# Altium schematic sheet Schematic.SchDoc
size A2; SheetNumber: 1; SheetTotal: 1
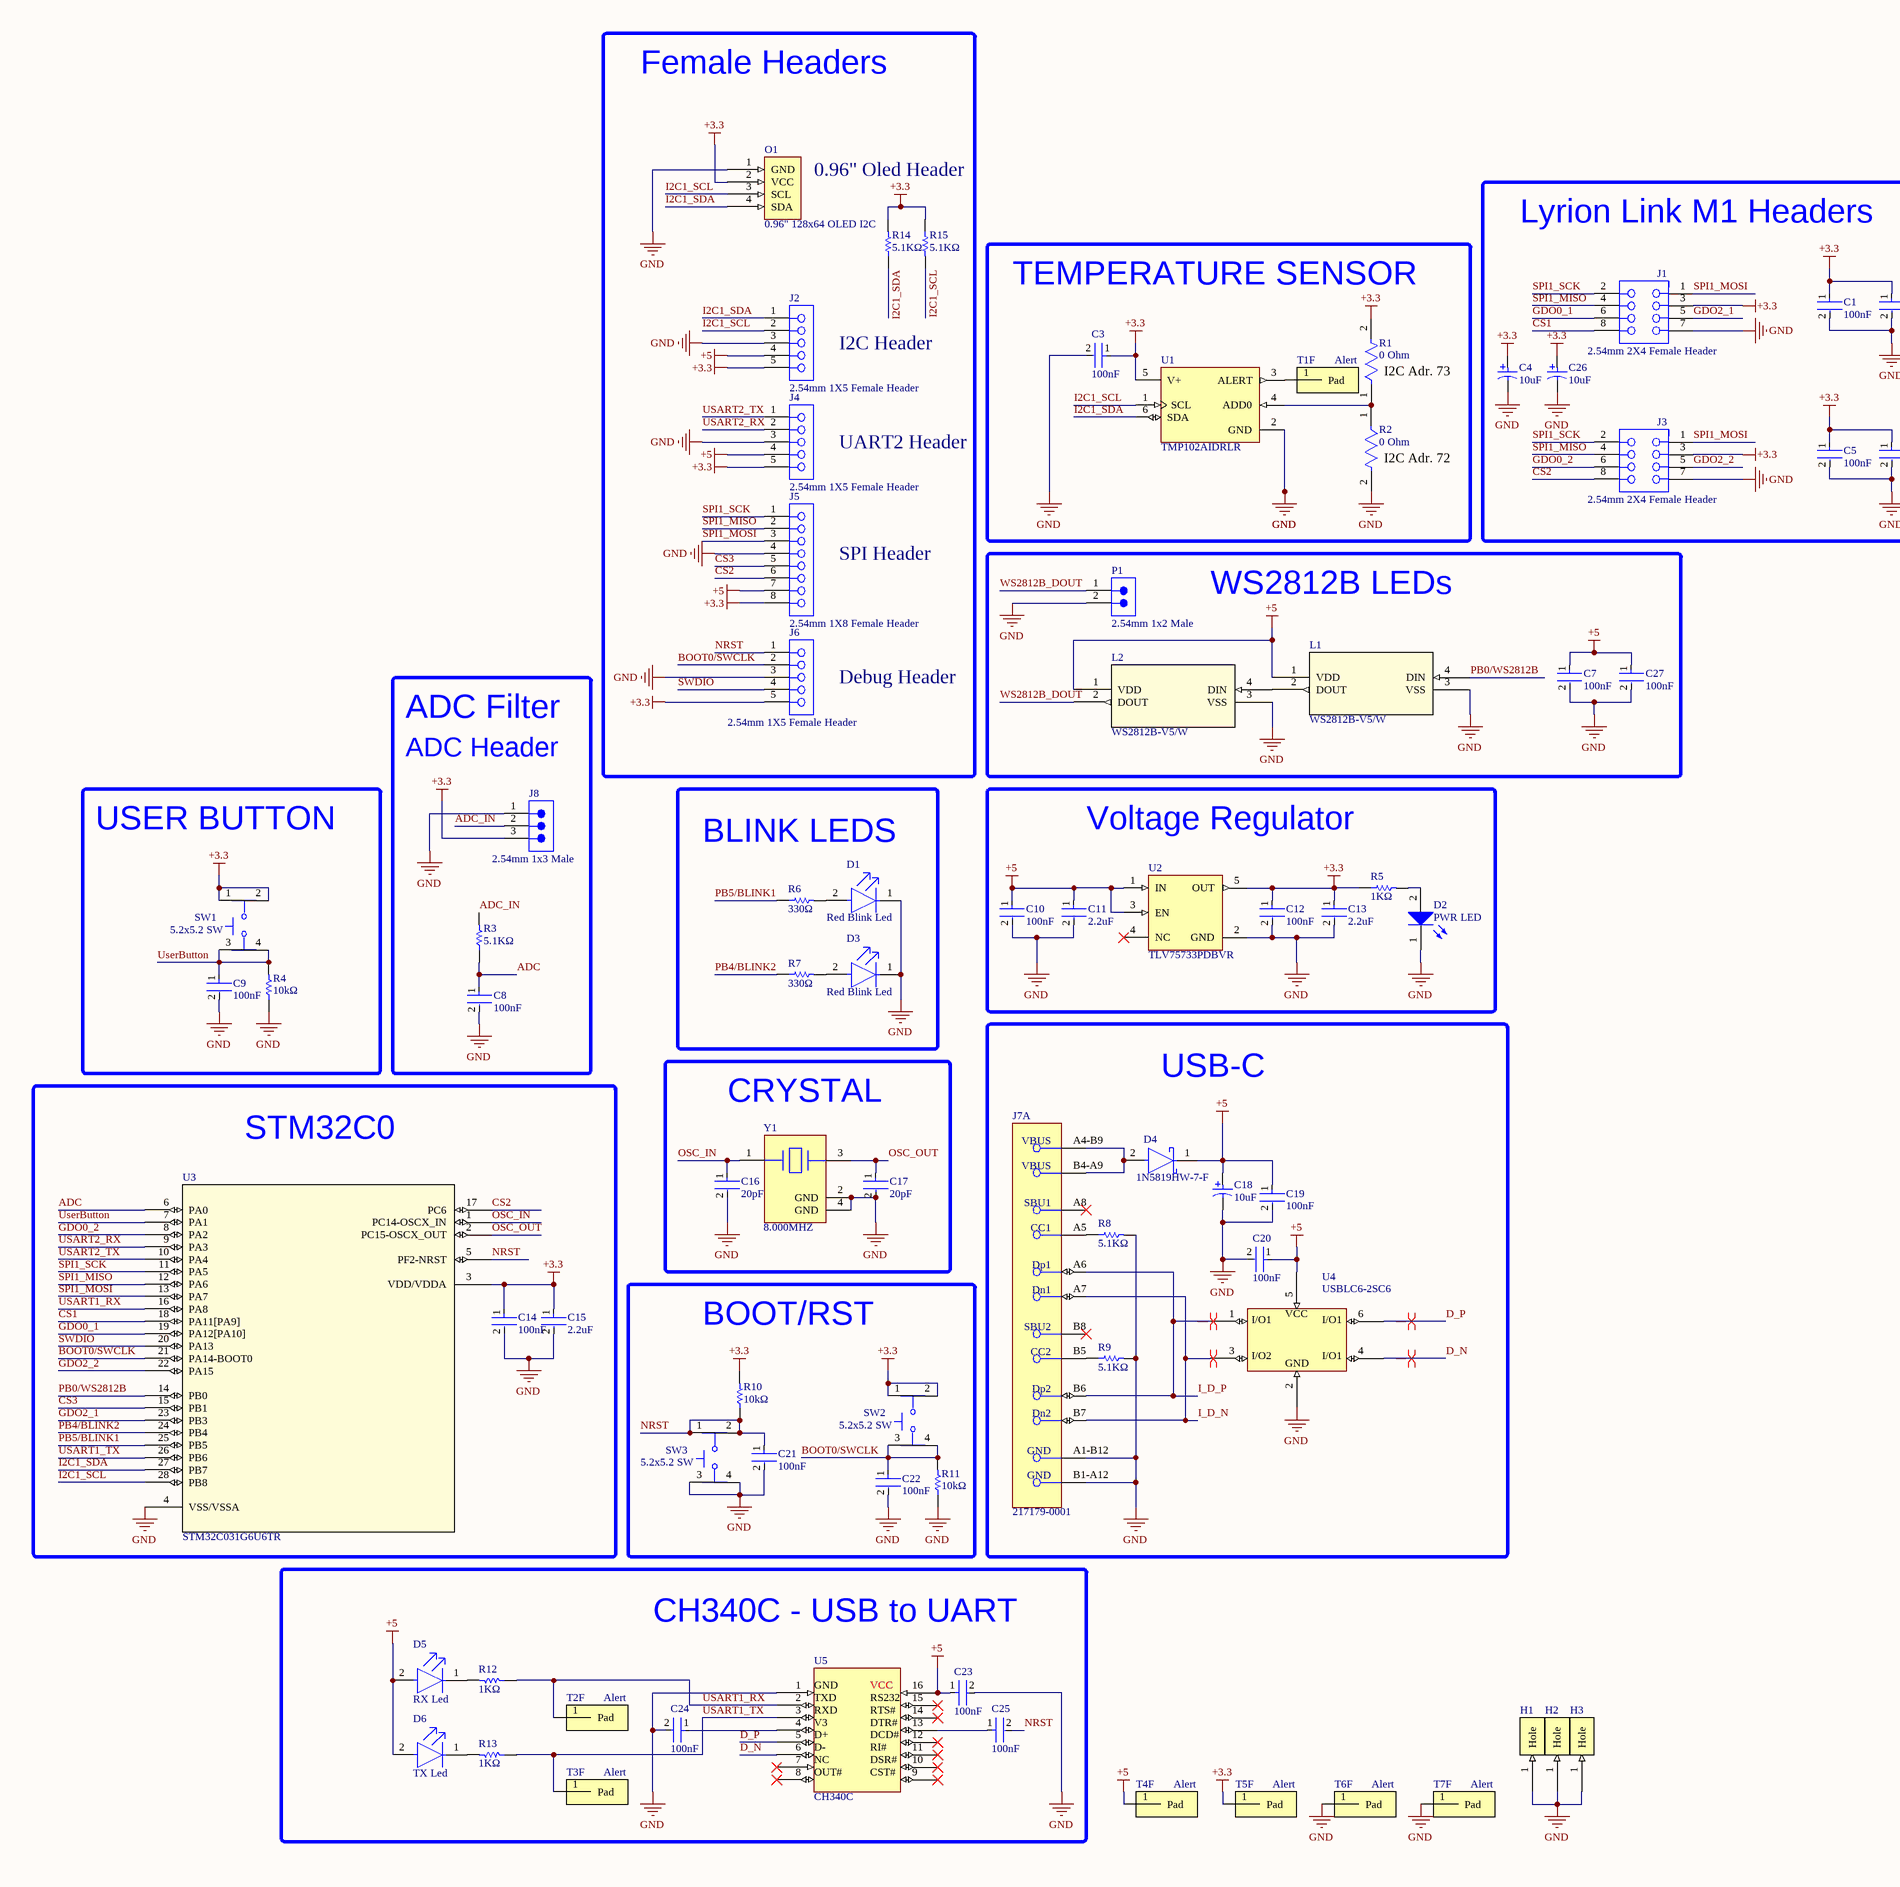
[diagram p0: Schematic.SchDoc, left]
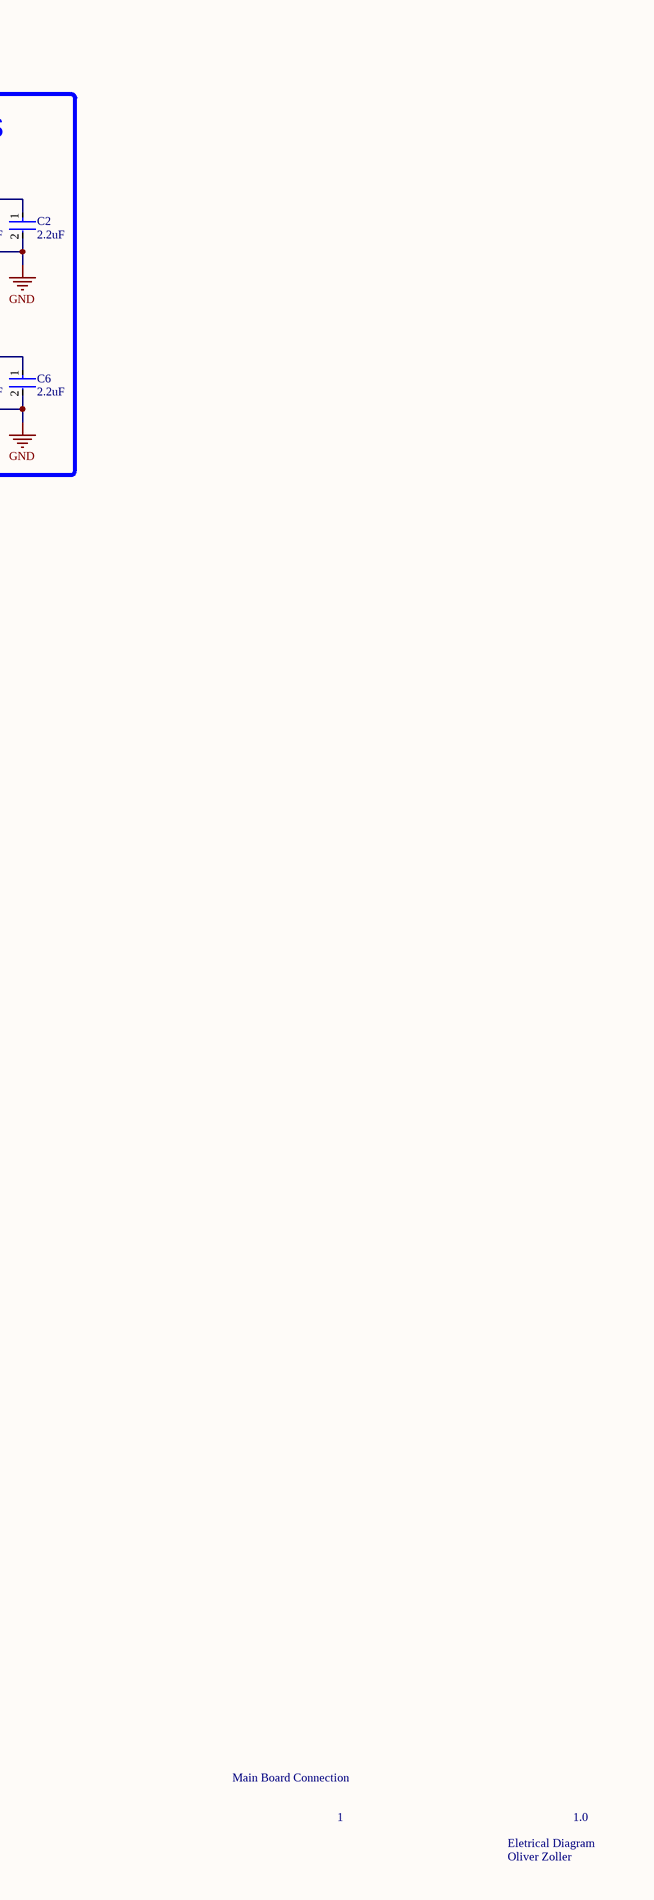
[diagram p1: Schematic.SchDoc, right]

## Parts
C1  100nF  [FP-CC0603-DA-IPC_B]
C2  2.2uF  [FP-CL10-IPC_B]
C3  100nF  [FP-CC0603-DA-IPC_B]
C4  10uF  [KEMT-A-3216-18-2_L]
C5  100nF  [FP-CC0603-DA-IPC_B]
C6  2.2uF  [FP-CL10-IPC_B]
C7  100nF  [FP-CC0603-DA-IPC_B]
C8  100nF  [FP-CC0603-DA-IPC_B]
C9  100nF  [FP-CC0603-DA-IPC_B]
C10  100nF  [FP-CC0603-DA-IPC_B]
C11  2.2uF  [FP-CL10-IPC_B]
C12  100nF  [FP-CC0603-DA-IPC_B]
C13  2.2uF  [FP-CL10-IPC_B]
C14  100nF  [FP-CC0603-DA-IPC_B]
C15  2.2uF  [FP-CL10-IPC_B]
C16  20pF  [FP-CC0603-0_9-IPC_A]
C17  20pF  [FP-CC0603-0_9-IPC_A]
C18  10uF  [KEMT-A-3216-18-2_L]
C19  100nF  [FP-CC0603-DA-IPC_B]
C20  100nF  [FP-CC0603-DA-IPC_B]
C21  100nF  [FP-CC0603-DA-IPC_B]
C22  100nF  [FP-CC0603-DA-IPC_B]
C23  100nF  [FP-CC0603-DA-IPC_B]
C24  100nF  [FP-CC0603-DA-IPC_B]
C25  100nF  [FP-CC0603-DA-IPC_B]
C26  10uF  [KEMT-A-3216-18-2_L]
C27  100nF  [FP-CC0603-DA-IPC_B]
D1  Red Blink Led  [FP-LTST-C190KRKT-MFG]
D2  PWR LED  [WL-SMCW_0603_150060xx75000]
D3  Red Blink Led  [FP-LTST-C190KRKT-MFG]
D4  1N5819HW-7-F  [FP-SOD123-IPC_C]
D5  RX Led  [FP-LTST-C190KRKT-MFG]
D6  TX Led  [FP-LTST-C190KRKT-MFG]
H1  M3 Mouting hole  [M3 Mouting hole-Footprint-1]  (value not drawn)
H2  M3 Mouting hole  [M3 Mouting hole-Footprint-1]  (value not drawn)
H3  M3 Mouting hole  [M3 Mouting hole-Footprint-1]  (value not drawn)
J1  2.54mm 2X4 Female Header  [61300821821]
J2  2.54mm 1X5 Female Header  [61300511821]
J3  2.54mm 2X4 Female Header  [61300821821]
J4  2.54mm 1X5 Female Header  [61300511821]
J5  2.54mm 1X8 Female Header  [61300811821]
J6  2.54mm 1X5 Female Header  [61300511821]
J7  217179-0001  [FP-2171790001-MFG]  (part A of 2)
J8  2.54mm 1x3 Male  [61300311121]
L1  WS2812B-V5/W  [WS2812B-V5_W-Footprint-1]
L2  WS2812B-V5/W  [WS2812B-V5_W-Footprint-1]
O1  0.96" 128x64 OLED I2C  [0.96" 128x64 OLED I2C-Footprint-1]
P1  2.54mm 1x2 Male  [61300211121]
R1  0 Ohm  [FP-RC0603-MFG]
R2  0 Ohm  [FP-RC0603-MFG]
R3  5.1KΩ  [RESC1608X55X25ML10T15]
R4  10kΩ  [RESC1609X50X30ML8T20]
R5  1KΩ  [RESC1608X55X25ML10T15]
R6  330Ω  [RESC1608X55X25LL10T15]
R7  330Ω  [RESC1608X55X25LL10T15]
R8  5.1KΩ  [RESC1608X55X25ML10T15]
R9  5.1KΩ  [RESC1608X55X25ML10T15]
R10  10kΩ  [RESC1609X50X30ML8T20]
R11  10kΩ  [RESC1609X50X30ML8T20]
R12  1KΩ  [RESC1608X55X25ML10T15]
R13  1KΩ  [RESC1608X55X25ML10T15]
R14  5.1KΩ  [RESC1608X55X25ML10T15]
R15  5.1KΩ  [RESC1608X55X25ML10T15]
SW1  5.2x5.2 SW  [FP-TL3342F450QG-MFG]
SW2  5.2x5.2 SW  [FP-TL3342F450QG-MFG]
SW3  5.2x5.2 SW  [FP-TL3342F450QG-MFG]
T1  Alert  [Test Pad-Footprint-1]  (part F of 6)
T2  Alert  [Test Pad-Footprint-1]  (part F of 6)
T3  Alert  [Test Pad-Footprint-1]  (part F of 6)
T4  Alert  [Test Pad-Footprint-1]  (part F of 6)
T5  Alert  [Test Pad-Footprint-1]  (part F of 6)
T6  Alert  [Test Pad-Footprint-1]  (part F of 6)
T7  Alert  [Test Pad-Footprint-1]  (part F of 6)
U1  TMP102AIDRLR  [FP-DRL0006A-MFG]
U2  TLV75733PDBVR  [FP-DBV0005A-MFG]
U3  STM32C031G6U6TR  [UFQFPN-28_STM]
U4  USBLC6-2SC6  [STM-SOT23-6L_V]
U5  CH340C  [CH340C-Footprint-1]
Y1  8.000MHZ  [FP-ABM3B-MFG]

## Blocks framed on the sheet
Female Headers: J2 J4-J6 O1 R14 R15
Lyrion Link M1 Headers: C1 C2 C4-C6 C26 J1 J3
TEMPERATURE SENSOR: C3 R1 R2 T1 U1
WS2812B LEDs: C7 C27 L1 L2 P1
ADC Filter: C8 J8 R3
USER BUTTON: C9 R4 SW1
BLINK LEDS: D1 D3 R6 R7
Voltage Regulator: C10-C13 D2 R5 U2
USB-C: C18-C20 D4 J7 R8 R9 U4
CRYSTAL: C16 C17 Y1
STM32C0: C14 C15 U3
BOOT/RST: C21 C22 R10 R11 SW2 SW3
CH340C - USB to UART: C23-C25 D5 D6 R12 R13 T2 T3 U5

## Nets
+3.3: C1.1 C2.1 C3.1 C4.1 C5.1 C6.1 C12.1 C13.1 C14.1 C15.1 C26.1 J1.3 J2.5 J3.3 J4.5 J5.8 J6.5 J8.3 O1.2(VCC) R1.2 R5.1 R10.2 R14.2 R15.1 SW1.1 SW1.2 SW2.1 SW2.2 T5.1(Pad) U1.5(V+) U2.5(OUT) U3.3(VDD/VDDA)
+5: C7.1 C10.1 C11.1 C18.1 C19.1 C20.1 C23.1 C27.1 D4.1(C) D5.2(A) D6.2(A) J2.4 J4.4 J5.7 L1.1(VDD) L2.1(VDD) T4.1(Pad) U2.1(IN) U2.3(EN) U4.5 U5.16
GND: C1.2 C2.2 C3.2 C4.2 C5.2 C6.2 C7.2 C8.2 C9.2 C10.2 C11.2 C12.2 C13.2 C14.2 C15.2 C16.2 C17.2 C18.2 C19.2 C20.2 C21.2 C22.2 C23.2 C24.2 C26.2 C27.2 D1.1(C) D2.1(K) D3.1(C) H1.1(Hole) H2.1(Hole) H3.1(Hole) J1.7 J2.3 J3.7 J4.3 J5.4 J6.3 J7.A1-B12(GND) J7.B1-A12(GND) J8.1 L1.3(VSS) L2.3(VSS) O1.1(GND) P1.2 R2.2 R4.1 R8.2 R9.2 R11.1 SW3.3 SW3.4 T6.1(Pad) T7.1(Pad) U1.2(GND) U2.2(GND) U3.4(VSS/VSSA) U4.2 U5.1 Y1.2(GND) Y1.4(GND)
ADC: C8.1 R3.1 U3.6(PA0)
ADC_IN: J8.2 R3.2
BOOT0/SWCLK: C22.1 J6.2 R11.2 SW2.3 SW2.4 U3.21(PA14-BOOT0)
CS1: J1.8 U3.18(PA11[PA9])
CS2: J3.8 J5.6 U3.17(PC6)
CS3: J5.5 U3.15(PB1)
D_N: U4.4 U5.6
D_P: U4.6 U5.5
GDO0_1: J1.6 U3.19(PA12[PA10])
GDO0_2: J3.6 U3.8(PA2)
GDO2_1: J1.5 U3.23(PB3)
GDO2_2: J3.5 U3.22(PA15)
I2C1_SCL: J2.2 O1.3(SCL) R15.2 U1.1(SCL) U3.28(PB8)
I2C1_SDA: J2.1 O1.4(SDA) R14.1 U1.6(SDA) U3.27(PB7)
I_D_N: J7.A7(Dn1) J7.B7(Dn2) U4.3
I_D_P: J7.A6(Dp1) J7.B6(Dp2) U4.1
NRST: C21.1 C25.2 J6.1 R10.1 SW3.1 SW3.2 U3.5(PF2-NRST)
OSC_IN: C16.1 U3.1(PC14-OSCX_IN) Y1.1
OSC_OUT: C17.1 U3.2(PC15-OSCX_OUT) Y1.3
PB0/WS2812B: L1.4(DIN) U3.14(PB0)
PB4/BLINK2: R7.1 U3.24(PB4)
PB5/BLINK1: R6.1 U3.25(PB5)
SPI1_MISO: J1.4 J3.4 J5.2 U3.12(PA6)
SPI1_MOSI: J1.1 J3.1 J5.3 U3.13(PA7)
SPI1_SCK: J1.2 J3.2 J5.1 U3.11(PA5)
SWDIO: J6.4 U3.20(PA13)
USART1_RX: R12.1 T2.1(Pad) U3.16(PA8) U5.2
USART1_TX: R13.1 T3.1(Pad) U3.26(PB6) U5.3
USART2_RX: J4.2 U3.9(PA3)
USART2_TX: J4.1 U3.10(PA4)
UserButton: C9.1 R4.2 SW1.3 SW1.4 U3.7(PA1)
WS2812B_DOUT: L2.2(DOUT) P1.1
NetC24_1: C24.1 U5.4
NetC25_1: C25.1 U5.13
NetD1_2: D1.2(A) R6.2
NetD2_2: D2.2(A) R5.2
NetD3_2: D3.2(A) R7.2
NetD4_2: D4.2(A) J7.A4-B9(VBUS) J7.B4-A9(VBUS)
NetD5_1: D5.1(C) R12.2
NetD6_1: D6.1(C) R13.2
NetJ7_A5: J7.A5(CC1) R8.1
NetJ7_B5: J7.B5(CC2) R9.1
NetL1_2: L1.2(DOUT) L2.4(DIN)
NetR1_1: R1.1 R2.1 U1.4(ADD0)
NetT1_1: T1.1(Pad) U1.3(ALERT)

Not connected (* = marked no-connect by the designer): J7 A8(SBU1)* B8(SBU2)*; U2 4(NC)*; U5 7* 8* 9* 10* 11* 12* 14* 15*

## Layout directives
differential pair; net class USB: D_N, D_P, I_D_N, I_D_P

## Notes on the sheet
- 0.96" Oled Header
- I2C Header
- (near R1) I2C Adr. 73
- UART2 Header
- (near R2) I2C Adr. 72
- SPI Header
- Debug Header
- ADC Header
- Main Board Connection
- 1
- Oliver Zoller
- Eletrical Diagram
- 1.0
- (in symbol CMP-005-000002-2) VCC; I/O1; I/O2; GND
- (in symbol CMP-005-000004-1) GND; VCC; TXD; RS232; RXD; RTS#; V3; DTR#; D+; DCD#; D-; RI#; NC; DSR#; OUT#; CST#

## Library data of the parts
C1 C3 C5 C7-C10 C12 C14 C19-C25 C27 = CMP-00018-3: 100nF 0603 10% 50V; Dielectric Material: Ceramic; Dielectric: X7R; Introduction Date: 2005-08-18; Width: 800µm; Length: 1.6mm; RoHS: Compliant; REACH SVHC: Yes; Number of Terminals: 2; Height: 800µm; Halogen Free: Halogen Free; Harmonized Tariff Schedule (HTS) Code: 8532.24.00.20; Voltage: 50V; Schedule B: 8532240020, 8532240020; Voltage Rating (DC): 50V; Case Code (Imperial): 0603; Value: 100nF; Lead Free: Lead Free; Pins: 2; Thickness: 889µm; Max Operating Temperature: 125°C; Voltage Rating: 50V; Depth: 800µm; Lifecycle Status: Production; Export Control Classification Number (ECCN) Code: EAR99; Material: Ceramic; Termination: SMD/SMT; China RoHS: Compliant; Country of Origin: Mainland China, Taiwan; Case Code (Metric): 1608; Radiation Hardening: No; Tolerance: 10%; Mounting Technology: Surface Mount; Case/Package: 0603; Min Operating Temperature: -55°C
C2 C6 C11 C13 C15 = CMP-00001-2: 2.2uF 0603 10% 16V; Material: Ceramic; Dielectric: X5R; Value: 2.2µF; Tolerance: 10%; Harmonized Tariff Schedule (HTS) Code: 8532.24.00.20; Width: 800µm; Contact Plating: Tin; Depth: 800µm; Lifecycle Status: Production; Max Operating Temperature: 85°C; Voltage: 16V; Case Code (Metric): 1608; Mounting Technology: Surface Mount; Voltage Rating (DC): 16V; RoHS: Compliant; Voltage Rating: 16V; Number of Terminals: 2; Case/Package: 0603; Case Code (Imperial): 0603; Radiation Hardening: No; Schedule B: 8532240020, 8532240020; Height: 900µm; Country of Origin: Mainland China, Philippines, South Korea; REACH SVHC: Yes; Export Control Classification Number (ECCN) Code: EAR99; Min Operating Temperature: -55°C; Dielectric Material: Ceramic; Thickness: 889µm; Length: 1.6mm; Lead Free: Lead Free; China RoHS: Compliant; Introduction Date: 2007-03-23
C4 C18 C26 = CMP-00003-2: 10uF 0603 10%; Voltage Rating (DC): 10V; Life (Hours): 2000hours; Value: 10µF; Ripple Current: 55mA; Polarity: Polar; ESR (Equivalent Series Resistance): 3.8Ω; Leakage Current: 1µA; Dielectric Material: Tantalum; Dissipation Factor: 6%; Lifecycle Status: Production; Voltage: 10V; Length: 3.2mm; Packaging: Cut Tape; Features: General Purpose; Lead Free: Lead Free; Pins: 2; Width: 1.6mm; Case Code (Imperial): 1206; Termination: SMD/SMT; Min Operating Temperature: -55°C; RoHS: Compliant; Case Code (Metric): 3216; Height: 1.6mm; Depth: 1.6mm; Schedule B: 8532210050, 8532210050; Case/Package: 1206; REACH SVHC: Yes; Mounting Technology: Surface Mount; Max Operating Temperature: 125°C; Voltage Rating: 10V; Tolerance: 10%; China RoHS: Compliant; Height - Seated (Max): 1.8034mm; Number of Terminals: 2
C16 C17 = CMP-00011-2: 20pF 0603 5% 50V; Material: Ceramic; Temperature Coefficient: 30ppm/°C; Dielectric: C0G; Thickness: 889µm; Mounting Technology: Surface Mount; Case/Package: 0603; Composition: Ceramic; Max Operating Temperature: 125°C; REACH SVHC: Yes; Width: 800µm; Pins: 2; Case Code (Metric): 1608; Min Operating Temperature: -55°C; Length: 1.6mm; Voltage Rating (DC): 50V; RoHS: Compliant; Value: 20pF; Height: 800µm; Lifecycle Status: Production; China RoHS: Compliant; Lead Free: Lead Free; Schedule B: 8532240020, 8532240020; Case Code (Imperial): 0603; Number of Terminals: 2; Dielectric Material: Ceramic; Weight: 2.012816mg; Tolerance: 5%; Halogen Free: Halogen Free; Voltage Rating: 50V; Depth: 800µm; Termination: SMD/SMT
D1 D3 D5 D6 = CMP-00006-1: LED red 0603 wavelength 631nm light intensity 18~180mcd Front Mounting; Lens Style: Clear; Number of Circuits: 1; Forward Current: 25mA; Shape: Rectangular; Test Current: 20mA; Power Dissipation: 62.5mW; Reverse Voltage: 5V; Tolerance: 20%; Voltage Rating: 50V; Viewing Angle: 260°; Forward Voltage: 2.4V; Value: 100µF; Lens Color: Clear, Colorless; Power Rating: 75mW; Luminous Intensity: 18mcd; Peak Wavelength: 639nm; Color: Red; Schedule B: 8541402000, 8541402000; Export Control Classification Number (ECCN) Code: EAR99; Diameter: 8mm; Lead Pitch: 3.5mm; Harmonized Tariff Schedule (HTS) Code: 8541.40.20.00; Case Code (Metric): 1608; Number of LEDs: 1; Wavelength: 631nm; Height: 800µm; Lead Free: Lead Free; Max Operating Temperature: 85°C; Lens Transparency: Clear; Width: 800µm; Number of Elements: 1; Mounting Technology: Surface Mount; Country of Origin: Mainland China; Illumination Color: Red; REACH SVHC: Yes; RoHS: Compliant; Dominant Wavelength: 631nm; Case/Package: 0603; Packaging: Bulk; Length: 11.5mm; Radiation Hardening: No; Number of Terminals: 2; Min Operating Temperature: -30°C; Case Code (Imperial): 0603; Lifecycle Status: Production; Introduction Date: 2000-01-01; China RoHS: Compliant; Depth: 800µm; Voltage Rating (DC): 50V; Pins: 2
D2 = CMP-00005-1: WL-SMCW SMT Mono-Color Chip LED Waterclear; Peak Wavelength: 465nm; Reverse Voltage: 5V; Max Junction Temperature (Tj): 95°C; Viewing Angle: 140°; Wavelength: 470nm; Luminous Intensity: 145mcd; Lens Style: Clear, Rectangular; Forward Current: 100mA; Power Dissipation: 105mW; Test Current: 20mA; Color: Blue; Forward Voltage: 3.2V; Length: 1.6mm; Dominant Wavelength: 470nm; Max Operating Temperature: 85°C; Width: 800µm; REACH SVHC: Unknown; Case/Package: 0603; Packaging: Tape and Reel; Max Reverse Voltage (DC): 5V; Mounting Technology: Surface Mount; Case Code (Metric): 1608; Min Operating Temperature: -40°C; RoHS: Compliant; Height: 700µm; Case Code (Imperial): 0603
D4 = CMP-00060-1: Schottky Diode SOD-123 40V 1A; Forward Voltage: 750mV; Peak Reverse Current: 1mA; Value: 50pF; Max Junction Temperature (Tj): 125°C; Max Power Dissipation: 450mW; Max Forward Surge Current (Ifsm): 25A; Number of Elements: 1; Polarity: Standard; Element Configuration: Single; Packaging: Tape and Reel; China RoHS: Compliant; Max Output current: 1A; Length: 2.85mm; Forward Current: 1A; Schedule B: 8541100080, 8541100080; Voltage Rating (DC): 40V; Reverse Standoff Voltage: 40V; Contact Plating: Tin; Case/Package: SOD-123-2; Output Current: 1A; Average Rectified Current: 1A; Width: 1.7mm; Min Operating Temperature: -65°C; Max Reverse Voltage (DC): 40V; RoHS: Compliant; Reverse Voltage: 40V; Peak Non-Repetitive Surge Current: 25A; Max Operating Temperature: 125°C; REACH SVHC: Yes; Lifecycle Status: Production; Current Rating: 1A; Weight: 10.007382mg; Height: 1.45mm; Max Repetitive Reverse Voltage (Vrrm): 40V; Number of Terminals: 2; Min Breakdown Voltage: 40V; Radiation Hardening: No; Pins: 2; Lead Free: Lead Free; Termination: SMD/SMT
H1-H3 = CMP-00087-1: hole for M3 screw
J1 J3 = CMP-00065-1: 8 Position Header Connector 0.100 (2.54mm) Through Hole Gold; Manufacturer Lifecycle Status: ACTIVE; Current Rating: 3A; Operating Supply Voltage: 250V; Insulation Resistance: 1GΩ; YEOL: 1 = Estimated lifetime > 10 years; Contact Resistance: 20mΩ; Gender: Female; Contact Plating: Gold; Length: 10.66mm; Max Operating Temperature: 105°C; Min Operating Temperature: -40°C; Lead Pitch: 2.54mm; Pins: 8; RoHS: Compliant; Pitch: 2.54mm; Lifecycle Status: Production; Orientation: Vertical; Insulation Material: PBT; System: Connector
J2 J4 J6 = CMP-00066-1: WR-PHD 2.54 mm Socket Header; 5 pins; Manufacturer Lifecycle Status: ACTIVE; Insulation Resistance: 1GΩ; Current Rating: 3A; YEOL: 1 = Estimated lifetime > 10 years; Operating Supply Voltage: 250V; Contact Resistance: 20mΩ; Pins: 5; Lead Pitch: 2.54mm; RoHS: Compliant; Insulation Material: PBT; Max Operating Temperature: 105°C; Min Operating Temperature: -40°C; Length: 13.2mm; Lifecycle Status: Production; Contact Plating: Gold; Pitch: 2.54mm; Gender: Female; Orientation: Vertical
J5 = CMP-00070-1: Btb Conn, Rcpt, 8Pos, 1Row, 2.54Mm Rohs Compliant: Yes; Manufacturer Lifecycle Status: ACTIVE; Operating Supply Voltage: 250V; YEOL: 1 = Estimated lifetime > 10 years; Insulation Resistance: 1GΩ; Contact Resistance: 20mΩ; Current Rating: 3A; Lead Pitch: 2.54mm; Insulation Material: PBT; RoHS: Compliant; Length: 20.82mm; Pins: 8; Min Operating Temperature: -40°C; Lifecycle Status: Production; Max Operating Temperature: 105°C; Contact Plating: Gold; Orientation: Vertical; Pitch: 2.54mm; Gender: Female
J7 = CMP-00056-1: USB-C 16 pin; Contact Resistance: 50mΩ; Insulation Resistance: 100MΩ; Number of Ports: 1; Number of Contacts: 16; Gender: Female; USB Standard: USB 2.0; Voltage Rating: 30V; Dielectric Material: Polyamide; Current Rating: 1.25A; REACH SVHC: Yes; Introduction Date: 2021-08-30; Export Control Classification Number (ECCN) Code: EAR99; Number of Rows: 1; Min Operating Temperature: -40°C; Lifecycle Status: Production; Contact Material: Gold, Nickel; Terminal Pitch: 500µm; Max Operating Temperature: 85°C; RoHS: Compliant; China RoHS: Compliant; Country of Origin: Mainland China; Shell Finish: Nickel; Shell Material: Stainless Steel; Harmonized Tariff Schedule (HTS) Code: 8536.69.40.30; Color: Black; Height: 3.36mm; Number of Positions: 16
J8 = CMP-00078-1: WR-PHD Straight Male, PCB Header, Through Hole, 1 Rows, 3 Contacts, 2.54mm Pitch; Manufacturer Lifecycle Status: ACTIVE; Contact Resistance: 20mΩ; Voltage Rating: 250V; Number of Positions: 3; YEOL: 1 = Estimated lifetime > 10 years; Connector Type: Male Pin; Insulation Resistance: 1GΩ; Current Rating: 3A; System: Connector; Termination: Solder; Packaging: Bulk; Contact Plating: Gold; Pitch: 2.54mm; Contact Mating Length: 5.9944mm; Gender: Male; Pins: 3; Operating Supply Voltage: 250V; Min Operating Temperature: -40°C; Lifecycle Status: Production; Length: 7.62mm; Height: 8.94mm; Number of Rows: 1; Number of Contacts: 3; Lead Pitch: 2.54mm; Orientation: Vertical; Lead Free: Lead Free; Contact Material: Gold; Mounting Technology: Through Hole; RoHS: Compliant; Max Operating Temperature: 105°C; Color: Black
L1 L2 = CMP-00061-1: SMD5050-4P LED Addressable
O1 = CMP-00077-2: Display
P1 = CMP-00079-1: WR-PHD Straight Male, PCB Header, Through Hole, 1 Rows, 2 Contacts, 2.54mm Pitch; Manufacturer Lifecycle Status: ACTIVE; Contact Resistance: 20mΩ; Operating Supply Voltage: 250V; Connector Type: Male Pin; Number of Contacts: 2; Current Rating: 3A; Insulation Resistance: 1GΩ; YEOL: 1 = Estimated lifetime > 10 years; Max Operating Temperature: 105°C; Color: Black; Lifecycle Status: Production; Voltage Rating: 250V; Pitch: 2.54mm; Housing Material: PBT; Contact Gender: Male; Lead Free: Lead Free; Contact Plating: Gold; Height: 8.94mm; Packaging: Bulk; Gender: Male; Mounting Technology: Through Hole; Pins: 2; REACH SVHC: No; Number of Rows: 1; Termination: Through Hole; Contact Material: Gold; Orientation: Vertical; RoHS: Compliant; Length: 5.08mm; Lead Pitch: 2.54mm; Contact Mating Length: 5.9944mm; Min Operating Temperature: -40°C; Number of Positions: 2
R1 R2 = CMP-00032-1: 0 Ohm 0603; Max Power Dissipation: 100mW; Voltage Rating (DC): 50V; Tolerance: 1%; Temperature Coefficient: 200ppm/°C; Current Rating: 1A; Working Voltage: 75V; Value: 0Ω; RoHS: Compliant; REACH SVHC: Yes; Case/Package: 0603; Schedule B: 8533210045, 8533210045; Termination: SMD/SMT; China RoHS: Non-Compliant; Case Code (Imperial): 0603; Width: 800µm; Number of Terminals: 2; Pins: 2; Composition: Thick Film; Max Operating Temperature: 155°C; Lead Free: Lead Free; Contact Plating: Tin; Radiation Hardening: No; Lifecycle Status: Production; Height: 450µm; Length: 1.6mm; Power Rating: 100mW; Depth: 800µm; Military Standard: Not; Features: Moisture Resistant; Number of Terminations: 2; Min Operating Temperature: -55°C; Mounting Technology: Surface Mount; Packaging: Tape & Reel; Voltage Rating: 75V
R3 R8 R9 R14 R15 = CMP-00059-1: 5.1KΩ 0603 1% 75V; Voltage Rating (DC): 50V; Max Power Dissipation: 100mW; Temperature Coefficient: 100ppm/°C; Value: 5.1kΩ; Lifecycle Status: Production; REACH SVHC: Yes; Number of Terminals: 2; Min Operating Temperature: -55°C; Features: Moisture Resistant; Mounting Technology: Surface Mount; China RoHS: Non-Compliant; Length: 1.6mm; Height: 450µm; Width: 800µm; Case Code (Imperial): 0603; Depth: 800µm; Termination: SMD/SMT; Schedule B: 8533210045, 8533210045; Working Voltage: 75V; Military Standard: Not; Tolerance: 1%; Composition: Thick Film; Pins: 2; Number of Terminations: 2; Power Rating: 100mW; RoHS: Compliant; Max Operating Temperature: 155°C; Packaging: Tape & Reel; Lead Free: Lead Free; Case/Package: 0603; Voltage Rating: 75V
R4 R10 R11 = CMP-00055-1: 10kΩ 0603 1% 75V; Power Rating: 100mW; Temperature Coefficient: 100ppm/°C; Export Control Classification Number (ECCN) Code: EAR99; Working Voltage: 75V; Length: 1.55mm; Features: Automotive AEC-Q200; Case Code (Imperial): 0603; Schedule B: 8533210045, 8533210045; Width: 850µm; Contact Plating: Lead, Tin; Composition: Thick Film; Min Operating Temperature: -55°C; Country of Origin: Israel, Taiwan; Value: 10kΩ; Weight: 2.012816mg; Voltage Rating: 75V; Radiation Hardening: No; Number of Terminations: 2; Packaging: Tape and Reel; Height: 450µm; Depth: 850µm; Number of Terminals: 2; Termination: SMD/SMT; Pins: 2; Voltage Rating (DC): 75V; Lifecycle Status: Production; Case/Package: 0603; Tolerance: 1%; Military Standard: Not; China RoHS: Non-Compliant; Harmonized Tariff Schedule (HTS) Code: 8533.21.00.30; Lead Free: Lead Free; Introduction Date: 2005-02-16; Mounting Technology: Surface Mount; Ratings: AEC-Q200; Max Operating Temperature: 155°C; RoHS: Compliant; REACH SVHC: Yes; Max Power Dissipation: 100mW
R5 R12 R13 = CMP-009-00000-1: 1KΩ 0603 1% 75V; Temperature Coefficient: 100ppm/°C; Voltage Rating (DC): 50V; Power Rating: 100mW; Min Operating Temperature: -55°C; Schedule B: 8533210045, 8533210045; Pins: 2; Case/Package: 0603; Military Standard: Not; Lifecycle Status: Production; Number of Terminals: 2; Termination: SMD/SMT; RoHS: Compliant; Packaging: Tape & Reel; Composition: Thick Film; Tolerance: 1%; Height: 450µm; Voltage Rating: 75V; Number of Terminations: 2; Max Power Dissipation: 100mW; China RoHS: Non-Compliant; Features: Moisture Resistant; Lead Free: Lead Free; Case Code (Imperial): 0603; Mounting Technology: Surface Mount; Working Voltage: 75V; Width: 800µm; Max Operating Temperature: 155°C; Depth: 800µm; REACH SVHC: Yes; Length: 1.6mm; Value: 1kΩ
R6 R7 = CMP-00057-1: 330Ω 0603 ±1% 75V; ESR (Equivalent Series Resistance): 800mΩ; Temperature Coefficient: 100ppm/°C; Voltage Rating (DC): 16V; Power Rating: 100mW; Voltage Rating (AC): 50V; Composition: Thick Film; Case/Package: 0603; Height: 450µm; Pins: 2; Value: 330Ω; Schedule B: 8533210045, 8533210045; RoHS: Compliant; Case Code (Metric): 7343; Radiation Hardening: No; Max Operating Temperature: 155°C; Termination: SMD/SMT; Voltage Rating: 16V; Lead Free: Lead Free; Tolerance: 1%; Number of Terminations: 2; Number of Terminals: 2; REACH SVHC: Yes; Max Power Dissipation: 100mW; Length: 1.6mm; Mounting Technology: Surface Mount; Width: 800µm; Packaging: Tape and Reel; Depth: 800µm; Case Code (Imperial): 2917; Contact Plating: Tin; Min Operating Temperature: -55°C; Lifecycle Status: Production; Features: Moisture Resistant; China RoHS: Non-Compliant; Working Voltage: 75V
SW1-SW3 = CMP-00053-1: Tactile Switch  5.2x5.2 Round Button; Operating Force: 4.9N; Max Current Rating: 50mA; Max Voltage Rating (DC): 12V; Insulation Resistance: 100MΩ; Throw Configuration: SPST; Number of Positions: 1; Contact Resistance: 500mΩ; Electrical Life: 10kcycles; Actuator Length: 304.8µm; Min Operating Temperature: -20°C; Length: 5mm; Terminal Material: Brass; RoHS: Compliant; Mounting Technology: Surface Mount; Harmonized Tariff Schedule (HTS) Code: 8536.50.90.40; Lifecycle Status: Production; REACH SVHC: Yes; Lead Free: Lead Free; Contact Current Rating: 50mA; Max Operating Temperature: 70°C; Contact Plating: Silver; Life (Cycles): 10kcycles; Introduction Date: 2012-10-18; Voltage Rating (DC): 12V; Height: 800µm; Country of Origin: Mainland China; Color: Gold; Export Control Classification Number (ECCN) Code: EAR99
T1-T7 = CMP-00063-1: Pad for probing - soldering
U1 = CMP-00062-1: Digital Temperature Sensor -40℃~+125℃ I2C ±0.5℃ 1.4V~3.6V SOT-563 Analog and Digital Outpu; Manufacturer Lifecycle Status: ACTIVE; Nominal Supply Current: 85µA; Interface: 2-Wire, I2C, SMBus; Min Supply Voltage (DC): 1.4V; Output Type: Digital, I2C; Operating Supply Current: 1µA; Quiescent Current: 10µA; Output Voltage: 3.6V; Resolution: 1.5B; Number of Bits: 12; Accuracy: 2%; Max Junction Temperature (Tj): 150°C; Output Current: 3mA; Lead Free: Lead Free; RoHS: Compliant; Height: 600µm; Thickness: 550µm; Mounting Technology: Surface Mount; Width: 1.2mm; Case/Package: SOT-563; Min Operating Temperature: -40°C; Min Supply Voltage: 1.4V; Weight: 2.806603mg; Radiation Hardening: No; Max Supply Voltage (DC): 3.6V; Max Supply Voltage: 3.6V; Schedule B: 8542390000, 8542390000; Max Operating Temperature: 125°C; Lifecycle Status: Production; Ambient Temperature Range High: 125°C; Pins: 6; Length: 1.6mm; REACH SVHC: No
U2 = CMP-005-000003-1: LDO 3.3V 1A 5-SOT-23
U3 = CMP-005-000000-3: Mainstream Arm Cortex-M0+ MCU with 32 Kbytes of Flash memory, 12 Kbytes RAM, 48 MHz CPU, 2x USART, timers, ADC, comm. I/F, 2-3.6V; Manufacturer_Name: STMicroelectronics; Source: STM32C031G6U6TR.SchLib; Manufacturer_Part_Number: STM32C031G6U6TR; Type: Type; Copyright: Copyright (C) 2026 Ultra Librarian. All rights reserved.; RefDes: RefDes; Design Item ID: STM32C031G6U6TR
U4 = CMP-005-000002-2: USB ESD SOT-23-6 and Surge Protection (TVS/ESD)
U5 = CMP-005-000004-1: USB to Serial Port chip Transceiver 2Mbps USB 2.0 SOP-16 Interface Controllers RoHS; Manufacturer_Name: WCH; Source: https://www.lcsc.com/product-detail/C84681.html?spm=wm.gwc.xh.55.cbm___wm.sy.ssl.gwc&lcsc_vid=QQVdUgADR1gPUVVXRVZXVQJRRVdbBFZWEwdaVgBXQwAxVlNRTlBZUFFRRlZYUTtW; Manufacturer_Part_Number: CH340C; Type: USB 2.0; Design Item ID: C84681
Y1 = CMP-00054-2: Crystal 8MHz ±10ppm SMD5032-4P 20pF; Output Current: 1.8A; ESR (Equivalent Series Resistance): 200Ω; Load Capacitance: 18pF; Tolerance: 0.002%; Output Voltage: 3.3V; Min Supply Voltage: 8.2V; Max Supply Voltage: 45V; Frequency Stability: 50ppm; China RoHS: Compliant; Lead Free: Lead Free; Mounting Technology: Surface Mount; Pins: 4; RoHS: Compliant; Packaging: Rail/Tube; Lifecycle Status: Production; Radiation Hardening: No; Length: 5mm; Frequency: 8MHz; Weight: 120.003531mg; Frequency Tolerance: 0.002%; Height: 1.1mm; ESR: 200Ω; Termination: SMD/SMT; Case/Package: CSMD; Min Operating Temperature: -20°C; Composition: Ceramic; Width: 3.2mm; Max Operating Temperature: 70°C; Schedule B: 8541600025, 8541600025; REACH SVHC: Yes; Depth: 3.2mm